# EAGLE design kartusho (EAGLE 7.3.0)
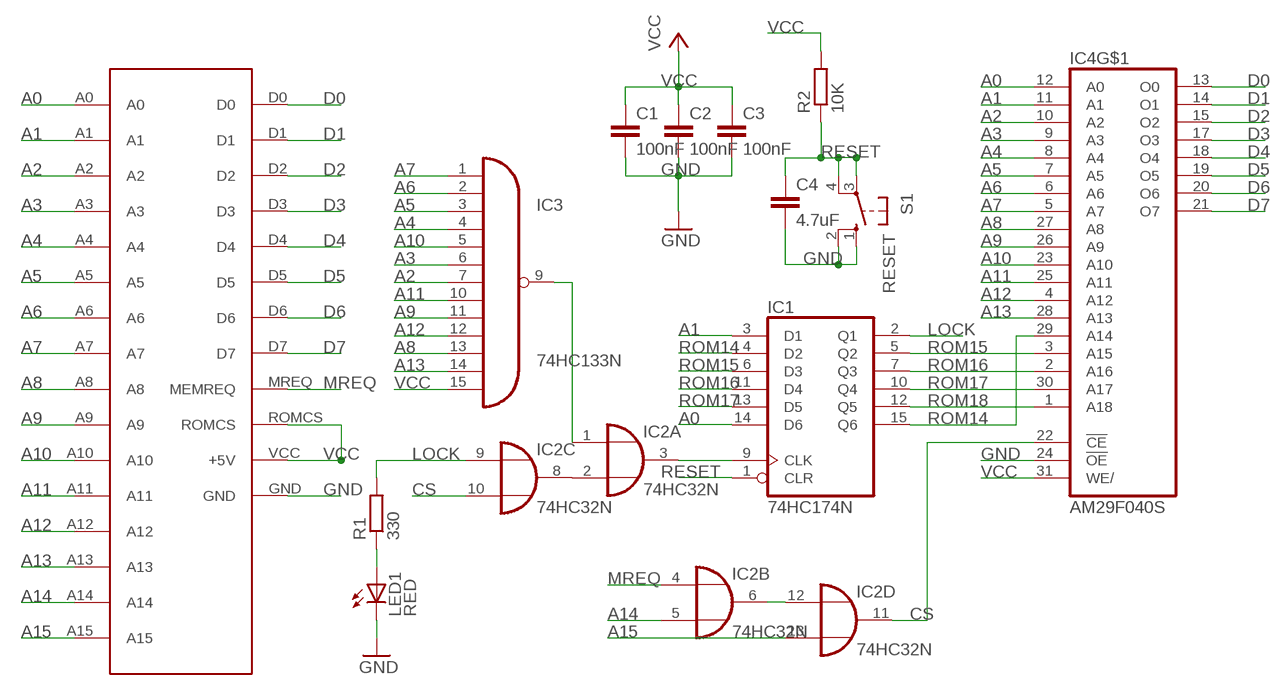
[diagram p0: schematic, sheet 1]

## Parts
C1  100nF  C-EU050-025X075  [C050-025X075]
C2  100nF  C-EU025-025X050  [C025-025X050]
C3  100nF  C-EU050-025X075  [C050-025X075]
C4  4.7uF  C-EU025-025X050  [C025-025X050]
IC1  74HC174N  [DIL16]
IC2  74HC32N  [DIL14]
IC3  74HC133N  [DIL16]
IC4  AM29F040S  [PLCC-SR32]
LED1  RED  LED3MM  [LED3MM]
R1  330  R-EU_0204/7  [0204/7]
R2  10K  R-EU_0204/7  [0204/7]
S1  RESET  10-XX  [B3F-10XX]
U$1  IF2BUS  [BUS_CARTUCHO_IF2]

## Nets
A0: IC1.14(D6) IC4.12(A0) U$1.A0
A1: IC1.3(D1) IC4.11(A1) U$1.A1
A2: IC3.7(I6) IC4.10(A2) U$1.A2
A3: IC3.6(I5) IC4.9(A3) U$1.A3
A4: IC3.4(I3) IC4.8(A4) U$1.A4
A5: IC3.3(I2) IC4.7(A5) U$1.A5
A6: IC3.2(I1) IC4.6(A6) U$1.A6
A7: IC3.1(I0) IC4.5(A7) U$1.A7
A8: IC3.13(I10) IC4.27(A8) U$1.A8
A9: IC3.11(I8) IC4.26(A9) U$1.A9
A10: IC3.5(I4) IC4.23(A10) U$1.A10
A11: IC3.10(I7) IC4.25(A11) U$1.A11
A12: IC3.12(I9) IC4.4(A12) U$1.A12
A13: IC3.14(I11) IC4.28(A13) U$1.A13
A14: IC2.5(B:I1) U$1.A14
A15: IC2.13(D:I1) U$1.A15
CS: IC2.10(C:I1) IC2.11(D:O) IC4.22(!CE)
D0: IC4.13(O0) U$1.D0
D1: IC4.14(O1) U$1.D1
D2: IC4.15(O2) U$1.D2
D3: IC4.17(O3) U$1.D3
D4: IC4.18(O4) U$1.D4
D5: IC4.19(O5) U$1.D5
D6: IC4.20(O6) U$1.D6
D7: IC4.21(O7) U$1.D7
GND: C1.2 C2.2 C3.2 C4.2 IC4.24(!OE) LED1.K(C) S1.1(S) S1.2(S1) U$1.GND
LOCK: IC1.2(Q1) IC2.9(C:I0) R1.2
MREQ: IC2.4(B:I0) U$1.MREQ(MEMREQ)
N$1: IC1.9(CLK) IC2.3(A:O)
N$2: IC2.6(B:O) IC2.12(D:I0)
N$3: IC2.2(A:I1) IC2.8(C:O)
N$4: IC2.1(A:I0) IC3.9(O)
N$7: LED1.A R1.1
RESET: C4.1 IC1.1(CLR) R2.1 S1.3(P) S1.4(P1)
ROM14: IC1.4(D2) IC1.15(Q6) IC4.29(A14)
ROM15: IC1.5(Q2) IC1.6(D3) IC4.3(A15)
ROM16: IC1.7(Q3) IC1.11(D4) IC4.2(A16)
ROM17: IC1.10(Q4) IC1.13(D5) IC4.30(A17)
ROM18: IC1.12(Q5) IC4.1(A18)
VCC: C1.1 C2.1 C3.1 IC3.15(I12) IC4.31(WE/) R2.2 U$1.ROMCS U$1.VCC(+5V)

## Power pins joined to a net without a drawn wire
GND: IC1.8(GND) IC2.7(P:GND) IC3.8(GND) IC4.16(GND)
VCC: IC1.16(VCC) IC2.14(P:VCC) IC3.16(VCC) IC4.32(VCC)

## Library data of the parts
C1-C4 = rcl:C-EU: CAPACITOR, European symbol
IC1 = 74xx-eu:74*174: Hex D type FLIP FLOP, clear
IC2 = 74xx-eu:74*32: Quad 2-input OR gate
IC3 = 74xx-eu:74*133: 13-input NAND gate
IC4 = am29-memory:AM29F040S
LED1 = led:LED: LED OSRAM: - CHIPLED LG R971, LG N971, LY N971, LG Q971, LY Q971, LO R971, LY R971 LH N974, LH R974 LS Q976, LO Q976, LY Q976 LO Q996 - Hyper CHIPLED LW Q18S LB Q993, LB Q99A, LB R99A - SideLED LS A670, LO A670, LY A670, LG A670, LP A670 LB A673, LV A673, LT A673, LW A673 LH A674 LY A675 LS A676, LA A676, LO A676, LY A676, LW A676 LS A679, LY A679, LG A679 - Hyper Micro SIDELED® LS Y876, LA Y876, LO Y876, LY Y876 LT Y87S - SmartLED LW L88C, LW L88S LB L89C, LB L89S, LG L890 LS L89K, LO L89K, LY L89K LS L896, LA L896, LO L896, LY L896 - TOPLED LS T670, LO T670, LY T670, LG T670, LP T670 LSG T670, LSP T670, LSY T670, LOP T670, LYG T670 LG T671, LOG T671, LSG T671 LB T673, LV T673, LT T673, LW T673 LH T674 LS T676, LA T676, LO T676, LY T676, LB T676, LH T676, LSB T676, LW T676 LB T67C, LV T67C, LT T67C, LS T67K, LO T67K, LY T67K, LW E67C LS E67B, LA E67B, LO E67B, LY E67B, LB E67C, LV E67C, LT E67C LW T67C LS T679, LY T679, LG T679 LS T770, LO T770, LY T770, LG T770, LP T770 LB T773, LV T773, LT T773, LW T773 LH T774 LS E675, LA E675, LY E675, LS T675 LS T776, LA T776, LO T776, LY T776, LB T776 LHGB T686 LT T68C, LB T68C - Hyper Mini TOPLED® LB M676 - Mini TOPLED Santana® LG M470 LS M47K, LO M47K, LY M47K Source: http://www.osram.convergy.de LUXEON: - LUMILED® LXK2-PW12-R00, LXK2-PW12-S00, LXK2-PW14-U00, LXK2-PW14-V00 LXK2-PM12-R00, LXK2-PM12-S00, LXK2-PM14-U00 LXK2-PE12-Q00, LXK2-PE12-R00, LXK2-PE12-S00, LXK2-PE14-T00, LXK2-PE14-U00 LXK2-PB12-K00, LXK2-PB12-L00, LXK2-PB12-M00, LXK2-PB14-N00, LXK2-PB14-P00, LXK2-PB14-Q00 LXK2-PR12-L00, LXK2-PR12-M00, LXK2-PR14-Q00, LXK2-PR14-R00 LXK2-PD12-Q00, LXK2-PD12-R00, LXK2-PD12-S00 LXK2-PH12-R00, LXK2-PH12-S00 LXK2-PL12-P00, LXK2-PL12-Q00, LXK2-PL12-R00 Source: www.luxeon.com KINGBRIGHT: KA-3528ASYC Source: www.kingbright.com
R1 R2 = rcl:R-EU_: RESISTOR, European symbol
S1 = switch-omron:10-XX: OMRON SWITCH; MPN: B3F-1000; OC_FARNELL: 176432; OC_NEWARK: 36M3542
U$1 = SPECTRUM:IF2BUS

## Board
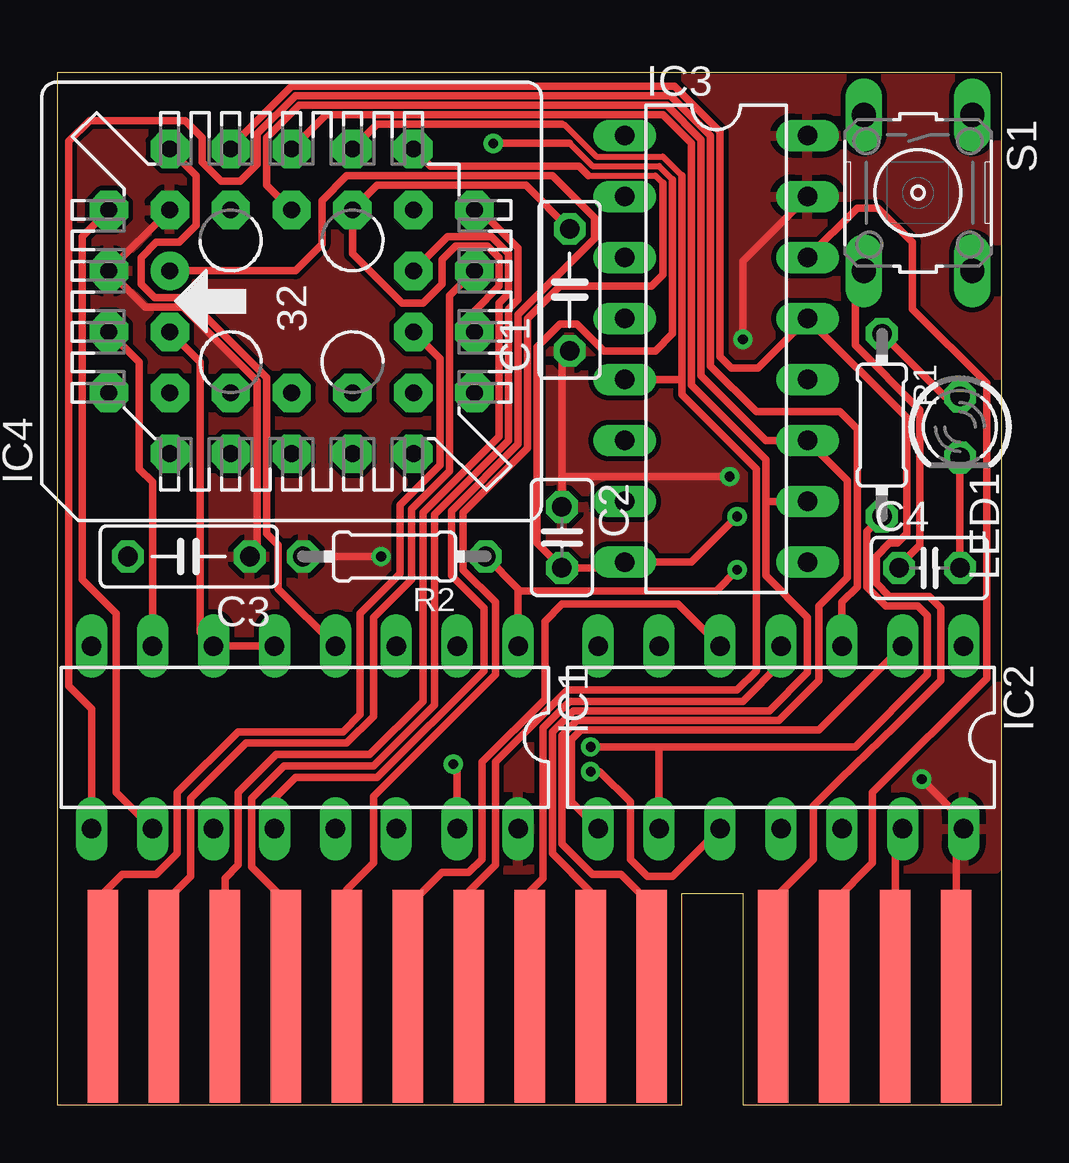
[diagram p1: board, top side]
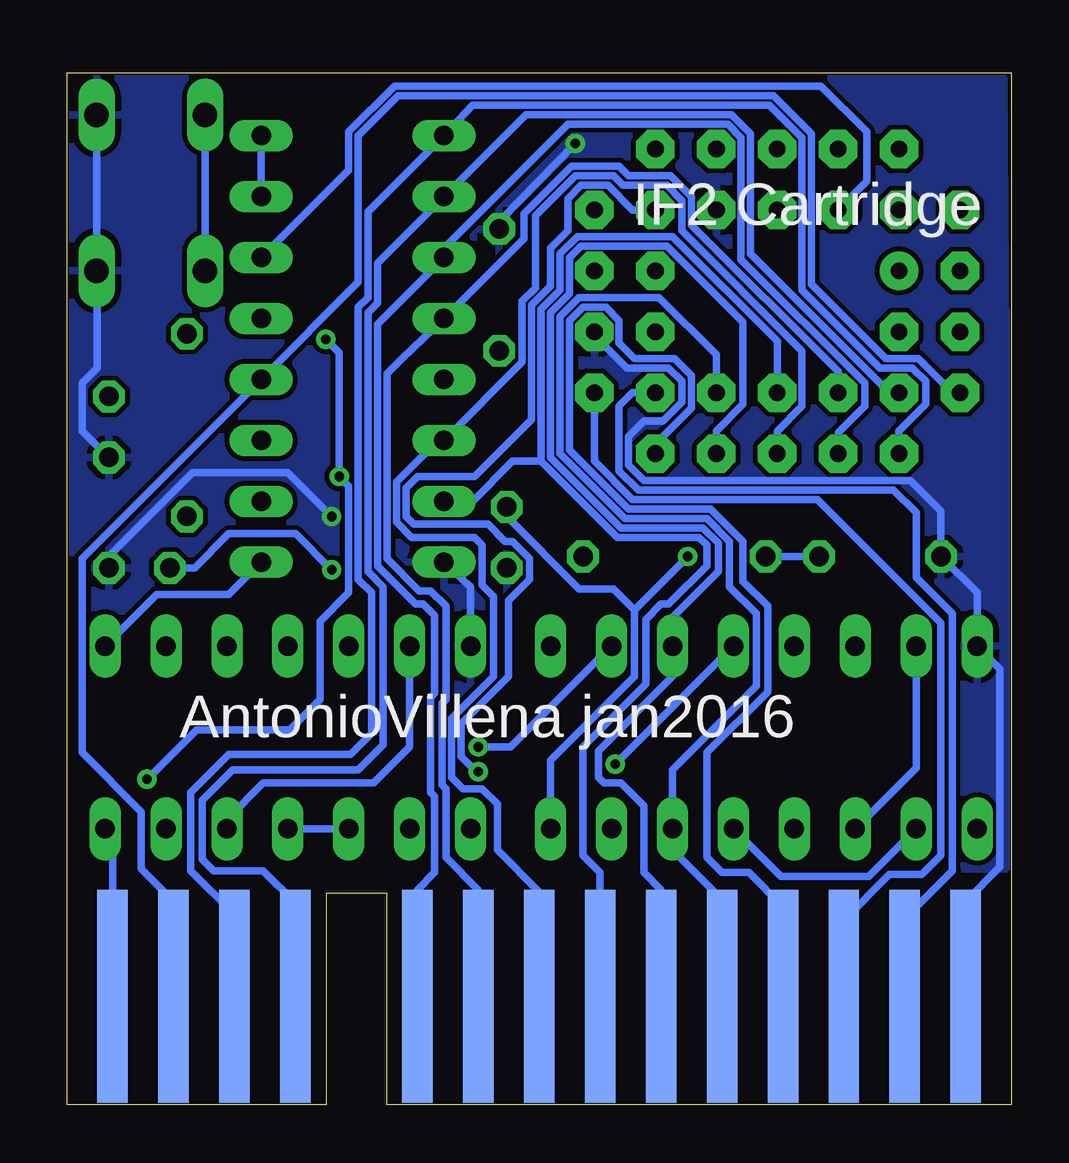
[diagram p2: board, bottom side, seen from below]

No outline drawn. Coordinates in mm, seen from the top.
Copper layers (1*16): Top 0.035mm / dielectric 1.5mm / Bottom 0.035mm
Design rules "default": minimum track width 10mil, minimum drill 24mil, track to track 8mil, track to pad 8mil, pad to pad 8mil, via to via 8mil, smd to smd 8mil, copper to edge 40mil, drill to drill 8mil, minimum pad ring 10mil, minimum via ring 8mil, stop-mask expansion 4mil, vias tented up to drill 0mil, thermal gap 10mil
Milling: 8 lines

### Footprints (pad centres in the part's own frame; a part is rotated, then mirrored left to right if it is on the bottom)
C050-025X075 = drill 0.813 octagon: 1 -2.54,0; 2 2.54,0
C025-025X050 = drill 0.813 octagon: 1 -1.27,0; 2 1.27,0
DIL16 = drill 0.813 long: 1 -8.89,-3.81; 2 -6.35,-3.81; 3 -3.81,-3.81; 4 -1.27,-3.81; 5 1.27,-3.81; 6 3.81,-3.81; 7 6.35,-3.81; 8 8.89,-3.81; 9 8.89,3.81; 10 6.35,3.81; 11 3.81,3.81; 12 1.27,3.81; 13 -1.27,3.81; 14 -3.81,3.81; 15 -6.35,3.81; 16 -8.89,3.81
DIL14 = drill 0.813 long: 1 -7.62,-3.81; 2 -5.08,-3.81; 3 -2.54,-3.81; 4 0,-3.81; 5 2.54,-3.81; 6 5.08,-3.81; 7 7.62,-3.81; 8 7.62,3.81; 9 5.08,3.81; 10 2.54,3.81; 11 0,3.81; 12 -2.54,3.81; 13 -5.08,3.81; 14 -7.62,3.81
PLCC-SR32 = drill 0.7 pad 1.6: 1 1.27,5.08 | drill 0.7 pad 1.6 octagon: 2 -1.27,7.62; 3 -1.27,5.08; 4 -3.81,7.62; 5 -6.35,5.08; 6 -3.81,5.08; 7 -6.35,2.54; 8 -3.81,2.54; 9 -6.35,0; 10 -3.81,0; 11 -6.35,-2.54; 12 -3.81,-2.54; 13 -6.35,-5.08; 14 -3.81,-7.62; 15 -3.81,-5.08; 16 -1.27,-7.62; 17 -1.27,-5.08; 18 1.27,-7.62; 19 1.27,-5.08; 20 3.81,-7.62; 21 6.35,-5.08; 22 3.81,-5.08; 23 6.35,-2.54; 24 3.81,-2.54; 25 6.35,0; 26 3.81,0; 27 6.35,2.54; 28 3.81,2.54; 29 6.35,5.08; 30 3.81,7.62; 31 3.81,5.08; 32 1.27,7.62
LED3MM = drill 0.813 octagon: A -1.27,0; K 1.27,0
0204/7 = drill 0.813 octagon: 1 -3.81,0; 2 3.81,0
B3F-10XX = drill 1.016 long: 1 -3.251,2.261; 2 3.251,2.261; 3 -3.251,-2.261; 4 3.251,-2.261
BUS_CARTUCHO_IF2 = smd 1.27 x 8.89 bottom: A0 -27.305,4.445; A1 -24.765,4.445; A2 -22.225,4.445; A3 -19.685,4.445; A4 -17.145,4.445; A5 -14.605,4.445; A6 -9.525,4.445; A7 -6.985,4.445; A12 -4.445,4.445; D0 -29.845,4.445; D1 -32.385,4.445; D2 -34.925,4.445; GND -37.465,4.445; ROMCS -1.905,4.445 | smd 1.27 x 8.89: A8 -9.525,4.445; A9 -14.605,4.445; A10 -22.225,4.445; A11 -17.145,4.445; A13 -6.985,4.445; A14 -24.765,4.445; A15 -4.445,4.445; D3 -37.465,4.445; D4 -34.925,4.445; D5 -32.385,4.445; D6 -29.845,4.445; D7 -27.305,4.445; MREQ -19.685,4.445; VCC -1.905,4.445

### Placement (x,y rotation side)
C1  21.35,33.97 90 top
C2  21.03,23.65 270 top
C3  5.48,22.86 180 top
C4  36.35,22.38 0 top
IC1  10.32,15.32 180 top
IC2  30.16,15.32 180 top
IC3  27.46,31.51 270 top
IC4  9.76,33.5 90 top
LED1  37.62,28.26 270 top
R1  34.37,28.34 270 top
R2  14.05,22.86 180 top
S1  35.88,38.02 270 top
U$1  39.37,0.08 0 top

### Tracks (layer width: path | path; a pad name or v marks a point on that pad's centre or on a via)
A0
  Bottom 0.305: U$1.A0 12.06,8.57 14.13,10.64 IC1.14 14.13,13.97 10.64,17.46 10.64,20.48 11.75,21.59 11.75,23.5 12.7,24.45 16.11,24.45 18.81,27.15 18.81,32.86 18.02,33.66 14.68,33.66 12.3,31.27 IC4.12
A1
  Bottom 0.305: U$1.A1 14.61,8.97 15.32,9.68 15.32,12.46 16.27,13.41 16.99,13.41 17.22,13.65 17.22,14.76 14.13,17.86 IC1.3 14.13,20.32 12.22,22.23 12.22,23.42 12.86,24.05 16.27,24.05 19.21,26.99 19.21,33.02 18.41,33.81 18.41,35.32 17.94,35.8 14.37,35.8 11.19,32.62 11.19,29.21 12.3,28.1 IC4.11
A2
  Bottom 0.305: U$1.A2 17.14,9.68 17.86,10.4 17.86,14.92 15.24,17.54 15.24,20.24 14.61,20.88 14.29,20.88 12.7,22.46 12.7,23.34 13.02,23.65 16.43,23.65 19.61,26.83 | IC4.10 9.76,31.83 14.13,36.2 18.1,36.2 18.81,35.48 18.81,33.97 19.61,33.18 19.61,26.83 | IC3.7 22.46,25.16 20.8,26.83 19.61,26.83
A3
  Bottom 0.305: U$1.A3 19.68,8.89 21.43,10.64 21.43,12.54 22.07,13.18 22.86,13.18 23.34,13.65 23.34,16.11 21.59,17.86 21.59,21.19 22.07,21.67 22.07,23.34 22.38,23.65 25,23.65 25.64,24.29 25.64,25.96 23.89,27.7 IC3.6 20.4,30.96 20.4,33.5 19.84,34.05 19.84,37.07 18.18,38.73 16.59,38.73 16.19,38.34 14.37,38.34 13.73,37.7 13.73,36.43 8.73,31.43 8.73,29.13 9.76,28.1 IC4.9
A4
  Bottom 0.305: U$1.A4 22.23,8.97 23.57,10.32 23.57,13.18 23.73,13.34 23.73,16.75 23.57,16.91 23.57,20.8 24.21,21.43 24.69,21.43 26.04,22.78 26.04,30.48 25.4,31.11 IC3.4 20.32,36.12 20.32,37.15 18.34,39.13 16.35,39.13 15.95,38.73 14.21,38.73 13.34,37.86 13.34,36.67 7.22,30.56 IC4.8
A5
  Bottom 0.305: IC4.7 7.22,28.02 6.11,29.13 6.11,30.08 11.27,35.24 11.27,40.32 11.83,40.88 18.49,40.88 23.65,35.72 IC3.3 26.43,32.54 26.43,22.46 24.84,20.88 24.53,20.88 24.05,20.4 24.05,17.14 24.21,16.99 24.21,13.02 24.05,12.86 24.05,9.68 24.77,8.97 U$1.A5
A6
  Bottom 0.305: IC4.6 5.08,29.69 10.87,35.48 10.87,40.48 11.67,41.27 20.24,41.27 IC3.2 26.43,35.08 26.43,33.42 26.83,33.02 26.83,22.23 26.19,21.59 26.19,15 27.23,13.97 32.46,13.97 33.73,12.7 33.73,10.24 33.26,9.76 31.19,9.76 29.84,8.41 U$1.A6
A7
  Bottom 0.305: IC4.5 4.68,28.1 3.57,29.21 3.57,30.16 4.13,30.72 5.48,30.72 8.73,33.97 8.73,40.32 10.08,41.67 22.46,41.67 IC3.1 26.83,37.23 26.83,33.66 27.23,33.26 27.23,21.91 26.67,21.35 26.67,15.48 27.54,14.61 32.62,14.61 34.21,13.02 34.21,9.76 32.38,7.94 U$1.A7
A8
  Top 0.305: U$1.A8 29.84,8.57 31.51,10.24 31.51,12.46 32.62,13.57 34.92,15.8 36.83,17.7 36.83,20.72 36.35,21.19 34.69,21.19 34.13,21.75 34.13,22.86 34.69,23.42 35,23.42 35.4,23.81 35.4,28.65 IC3.13 29.21,30.72 28.1,30.72 27.62,31.19 27.62,40.56 25.72,42.47 9.76,42.47 7.22,39.93 IC4.27
A9
  Top 0.305: U$1.A9 24.77,8.33 23.5,9.6 22.3,9.6 21.03,10.87 21.03,15.4 21.67,16.03 30.08,16.03 31.75,17.7 31.75,20.8 32.94,21.99 32.94,26.04 IC3.11 29.53,27.7 26.83,30.4 26.83,40.24 25.4,41.67 10.08,41.67 8.73,40.32 8.73,38.34 IC4.26
A10
  Top 0.254: 21.03,40.88 21.11,40.88 22.46,39.53 25.24,39.53 26.04,38.73
  Top 0.305: U$1.A10 17.14,8.89 18.26,10 18.26,14.29 21.27,17.3 28.34,17.3 29.13,18.1 29.13,26.51 26.04,29.61 26.04,30.24 | IC4.23 13.34,40.88 21.03,40.88 | 26.04,38.73 26.04,30.24 | IC3.5 26.04,30.24
A11
  Top 0.305: U$1.A11 22.23,8.89 20.64,10.48 20.64,15.56 21.51,16.43 29.69,16.43 31.27,18.02 31.27,20.32 29.53,22.07 29.53,25.24 | IC4.25 11.19,41.27 25.24,41.27 26.43,40.08 26.43,30 29.53,26.91 29.53,25.24 | IC3.10 29.61,25.16 29.53,25.24
A12
  Bottom 0.305: IC4.4 2.46,29.69 3.89,31.11 5.24,31.11 8.33,34.21 8.33,40.48 9.92,42.07 25.56,42.07 27.23,40.4 27.23,34.29 IC3.12 38.73,22.78 38.73,14.68 36.27,12.22 36.27,9.84 34.92,8.49 U$1.A12
A13
  Top 0.305: U$1.A13 32.38,8.49 33.97,10.08 33.97,13.02 38.73,17.78 38.73,30.08 35.64,33.18 35.64,35.96 34.21,37.39 33.34,37.39 IC3.14
  Bottom 0.305: IC4.28 6.03,38.5 6.03,40.56 7.94,42.47 25.72,42.47 27.62,40.56 27.62,38.97 IC3.14
A14
  Top 0.305: U$1.A14 14.61,8.26 16.03,9.68 17.14,9.68 17.7,10.24 17.7,14.29 20.32,16.91 20.32,20.16 21.03,20.88 25.88,20.88 IC2.5
A15
  Top 0.305: U$1.A15 34.92,11.19 IC2.13
CS  (via drill 0.4)
  Top 0.305: v22.23,13.89 22.62,13.89 23.89,12.62 23.89,10.24 24.61,9.53 25.64,9.53 IC2.10
  Bottom 0.305: IC4.22 15.8,37.31 16.83,38.34 17.94,38.34 18.49,37.78 18.49,36.43 19.21,35.72 19.21,34.13 20,33.34 20,28.57 22.38,26.19 24.77,26.19 25.24,25.72 25.24,24.53 24.92,24.21 21.83,24.21 21.11,23.5 20.8,23.5 20.08,22.78 20.08,21.91 20.95,21.03 20.95,17.86 22.94,15.88 22.94,14.53 22.3,13.89 v22.23,13.89 | IC2.11 IC2.10
D0
  Bottom 0.305: U$1.D0 9.53,8.26 10.95,9.68 12.06,9.68 12.7,10.32 12.7,14.68 10.16,17.22 10.16,20.8 11.19,21.83 11.19,23.5 12.54,24.84 15.95,24.84 18.41,27.3 18.41,32.7 17.86,33.26 16.91,33.26 16.35,32.7 16.35,31.75 15.72,31.11 14.05,31.11 13.34,30.4 13.34,29.05 14.84,27.54 IC4.13
D1
  Bottom 0.305: U$1.D1 6.99,7.7 5.08,9.6 3.73,9.6 2.94,10.4 2.94,20.08 8.1,25.24 15.8,25.24 17.38,26.83 IC4.14
D2
  Bottom 0.305: U$1.D2 4.45,7.78 2.46,9.76 2.46,20.48 3.97,21.99 3.97,24.69 4.92,25.64 15.56,25.64 16.35,26.43 16.35,29.13 15.8,29.69 IC4.15
D3
  Top 0.305: IC4.17 15.95,31.11 15.95,26.67 14.29,25 14.29,22.15 12.62,20.48 12.62,16.27 11.91,15.56 7.54,15.56 5,13.02 5,10.48 4.13,9.6 2.7,9.6 1.91,8.81 U$1.D3
D4
  Top 0.305: U$1.D4 4.45,8.41 5.56,9.53 5.56,12.78 7.86,15.08 12.06,15.08 13.18,16.19 13.18,20.32 14.76,21.91 14.76,24.84 16.35,26.43 16.35,33.73 IC4.18
D5
  Top 0.305: U$1.D5 6.99,9.45 7.54,10 7.54,13.02 9.13,14.61 13.02,14.61 15.24,16.83 15.24,24.69 18.41,27.86 18.41,33.42 18.81,33.81 18.81,35.48 18.1,36.2 16.27,36.2 IC4.19
D6
  Top 0.305: U$1.D6 9.53,8.49 8.1,9.92 8.1,12.78 9.45,14.13 13.18,14.13 15.72,16.67 15.72,24.61 18.81,27.7 18.81,33.18 19.21,33.58 19.21,35.72 17.62,37.31 IC4.20
D7
  Top 0.254: 22.15,38.73 24.92,38.73 25.24,38.42
  Top 0.305: U$1.D7 12.06,8.97 13.18,10.08 13.18,12.86 18.26,17.94 18.26,20.95 16.91,22.3 16.91,24.69 19.61,27.38 19.61,32.78 20.95,34.13 24.77,34.13 25.24,34.61 25.24,38.42 | 22.15,38.73 21.75,39.13 15.56,39.13 IC4.21
GND  (via drill 0.4)
  Top 0.254: 25.64,38.58 25.08,39.13 22.3,39.13 21.35,40.08
  Top 0.305: IC4.16 17.38,33.1 18.41,34.13 18.41,35.32 17.94,35.8 16.59,35.8 16.03,35.24 16.03,34.21 15.24,33.42 14.37,33.42 12.3,35.48 IC4.24 13.34,38.34 19.53,38.34 C1.2 | C4.2 LED1.K | v28.34,24.53 26.43,22.62 IC3.8 23.42,22.38 C2.2 20,23.42 20,31.59 20.95,32.54 21.67,32.54 22.78,31.43 24.92,31.43 25.64,32.15 25.64,38.58 | 21.35,40.08 v18.18,40.08
  Bottom 0.305: U$1.GND 1.91,8.49 0.48,9.92 0.48,18.18 IC1.8 1.43,21.35 C3.2 2.94,24.77 4.21,26.04 15.32,26.04 15.95,26.67 15.95,27.86 15.32,28.5 14.53,28.5 13.73,29.29 13.73,30.16 14.29,30.72 16.03,30.72 17.38,32.07 IC4.16 | IC2.7 22.54,21.59 IC3.8 | S1.1 S1.2 38.1,34.73 38.1,30.72 38.73,30.08 38.73,28.1 LED1.K | C4.2 37.62,22.86 34.13,26.35 30.16,26.35 v28.34,24.53 | v18.18,40.08 21.27,36.91 21.27,36.59 C1.2
  pour Bottom: 0.32,42.78 39.13,42.78 39.13,9.84 0.24,9.84 0.24,31.83
LOCK  (via drill 0.4)
  Top 0.305: IC2.9 25.08,14.92 | v22.23,14.92 25.08,14.92 | R1.2 33.73,23.89 33.73,21.59 34.53,20.8 35.88,20.8 36.27,20.4 36.27,17.94 33.26,14.92 25.08,14.92
  Bottom 0.305: IC1.2 20.88,14.92 v22.23,14.92
MREQ
  Top 0.305: U$1.MREQ 19.68,8.89 20.24,9.45 20.24,15.72 21.35,16.83 28.57,16.83 30.16,18.41 IC2.4
N$1
  Top 0.305: IC1.9 1.43,16.51 0.48,17.46 0.48,40.16 1.35,41.04 5.32,41.04 6.03,40.32 6.03,39.29 6.83,38.5 7.62,38.5 8.33,39.21 8.33,40.48 9.92,42.07 25.56,42.07 27.23,40.4 27.23,30.8 29.13,28.89 32.62,28.89 33.34,28.18 33.34,21.59 32.7,20.95 IC2.3
N$2
  Bottom 0.305: IC2.12 32.7,11.91 31.19,13.41 26.59,13.41 25.08,14.92 IC2.6
N$3
  Top 0.305: IC2.8 21.43,12.62 21.43,15.24 21.83,15.64 31.75,15.64 IC2.2
N$4
  Bottom 0.305: IC3.9 32.62,21.27 35.64,21.27 IC2.1
N$7
  Top 0.305: LED1.A 36.99,29.53 R1.1
RESET  (via drill 0.4)
  Top 0.305: IC1.1 19.21,21.35 | 19.21,21.35 19.21,21.51 R2.1 | C4.1 35.08,22.46 35.96,23.34 35.96,28.97 33.26,31.67 33.26,34.41 S1.4 | v28.34,22.3 27.46,21.43 19.29,21.43 19.21,21.35
  Bottom 0.305: S1.3 S1.4 | C4.1 34.05,22.38 32.62,23.81 29.84,23.81 v28.34,22.3
ROM14  (via drill 0.4)
  Top 0.305: IC1.15 16.67,14.05 v16.51,14.21 | IC1.4 9.21,21.51 9.21,23.34 8.73,23.81 8.73,30.32 5.4,33.66 4.05,33.66 3.49,34.21 3.49,35.32 4.13,35.96 5.08,35.96 5.79,36.67 5.79,38.73 IC4.29
  Bottom 0.305: IC1.4 v16.51,14.21
ROM15
  Top 0.305: IC1.5 IC1.6 5.95,19.68 5.95,30.96 IC4.3
ROM16
  Top 0.305: IC1.7 3.97,25.96 3.41,26.51 3.41,30.96 IC4.2
  Bottom 0.305: IC1.7 3.97,14.05 IC1.11
ROM17
  Top 0.305: IC1.10 2.46,13.02 2.46,20.48 1.03,21.91 1.03,36.2 IC4.30
  Bottom 0.305: IC1.13 9.6,9.53 5.95,9.53 IC1.10
ROM18
  Top 0.305: IC1.12 9.05,12.78 9.92,13.65 13.34,13.65 17.78,18.1 17.78,20.72 16.43,22.07 16.43,24.77 19.21,27.54 19.21,32.94 22.38,36.12 22.38,36.99 20.64,38.73 12.06,38.73 11.03,37.7 11.03,35.88 9.92,34.77 IC4.1
VCC  (via drill 0.4)
  Top 0.305: U$1.ROMCS 37.47,11.19 IC2.14 37.78,11.83 v36.04,13.57 | IC4.31 IC4.32 3.65,33.26 5.24,33.26 8.33,30.16 8.33,23.18 C3.1 | v13.49,22.86 R2.2 | C2.1 21.03,26.19 | 21.03,26.19 21.03,31.11 C1.1 | v28.02,26.19 21.03,26.19 | v28.57,31.91 28.57,35.16 IC3.15
  Bottom 0.305: U$1.ROMCS 37.47,11.19 IC2.14 | R2.2 C3.1 | IC1.16 19.21,14.37 15.72,17.86 15.72,20.64 | 15.72,20.64 v13.49,22.86 | 15.72,20.64 16.59,21.51 18.02,21.51 21.03,24.53 C2.1 | IC3.16 IC3.15 | v36.04,13.57 33.97,15.64 30.08,15.64 28.81,16.91 28.81,20.16 27.62,21.35 27.62,25.8 v28.02,26.19 28.02,31.35 v28.57,31.91
  pour Top: 0.32,42.78 39.13,42.78 39.13,9.84 0.32,9.76

### Text on the board
bPlace: IF2 Cartridge | AntonioVillena jan2016